# EAGLE design bt-snes-aa-ncp1402-attiny24 (EAGLE 6.1)
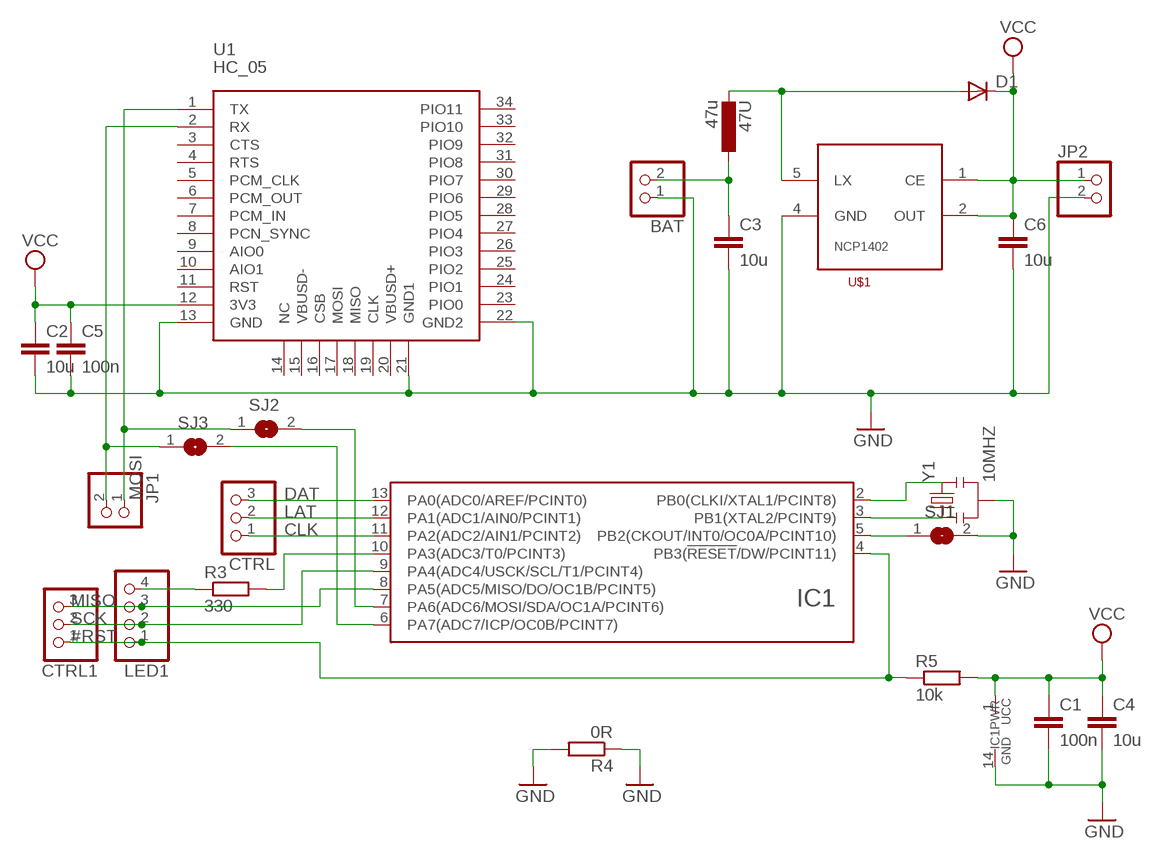
[diagram p0: schematic, sheet 1]

## Parts
47U  47u  L-EUL1210  [C1210]
BAT  PINHD-1X2  [1X02]
C1  100n  C-EUC0805K  [C0805K]
C2  10u  C-EUC0805K  [C0805K]
C3  10u  C-EUC0805K  [C0805K]
C4  10u  C-EUC0805K  [C0805K]
C5  100n  C-EUC0805K  [C0805K]
C6  10u  C-EUC1206  [C1206]
CTRL  PINHD-1X3  [1X03]
CTRL1  PINHD-1X3  [1X03]
D1  DIODE-SOD80C  [SOD80C]
IC1  ATTINY24/44/84-SSU  [SOIC14]
JP1  PINHD-1X2  [1X02]
JP2  PINHD-1X2  [1X02]
LED1  PINHD-1X4  [1X04]
R3  330  R-EU_M0805  [M0805]
R4  0R  R-EU_R1206W  [R1206W]
R5  10k  R-EU_M0805  [M0805]
SJ1  SJ  [SJ]
SJ2  SJ  [SJ]
SJ3  SJ  [SJ]
U1  HC_05  [BLUETOOTH_SMD]
U$1  NCP1402-SOT23-5  [SOT23-5]
Y1  10MHZ  RESONATOR8MHZ  [RESONATOR-SMD]

## Nets
#RST: CTRL1.1 IC1.4(PB3(!RESET!/DW/PCINT11)) LED1.1 R5.1
CLK: CTRL.1 IC1.11(PA2(ADC2/AIN1/PCINT2))
DAT: CTRL.3 IC1.13(PA0(ADC0/AREF/PCINT0))
GND: BAT.1 C1.2 C2.2 C3.2 C4.2 C5.2 C6.2 IC1.14(GND) JP2.2 R4.1 R4.2 SJ1.2 U1.13(GND) U1.21(GND1) U1.22(GND2) U$1.4(GND) Y1.2
LAT: CTRL.2 IC1.12(PA1(ADC1/AIN0/PCINT1))
MISO: CTRL1.3 IC1.8(PA5(ADC5/MISO/DO/OC1B/PCINT5)) LED1.3
MOSI: IC1.7(PA6(ADC6/MOSI/SDA/OC1A/PCINT6)) SJ2.2
N$1: IC1.3(PB1(XTAL2/PCINT9)) Y1.1
N$2: IC1.2(PB0(CLKI/XTAL1/PCINT8)) Y1.3
N$3: JP1.1 SJ2.1 U1.1(TX)
N$5: JP1.2 SJ3.1 U1.2(RX)
N$11: IC1.6(PA7(ADC7/ICP/OC0B/PCINT7)) SJ3.2
N$12: IC1.5(PB2(CKOUT/INT0/OC0A/PCINT10)) SJ1.1
N$13: 47U.1 BAT.2 C3.1
N$14: 47U.2 D1.A U$1.5(LX)
N$15: LED1.4 R3.1
N$20: IC1.10(PA3(ADC3/T0/PCINT3)) R3.2
SCK: CTRL1.2 IC1.9(PA4(ADC4/USCK/SCL/T1/PCINT4)) LED1.2
VCC: C1.1 C2.1 C4.1 C5.1 C6.1 D1.C IC1.1(UCC) JP2.1 R5.2 U1.12(3V3) U$1.1(CE) U$1.2(OUT)
Unconnected: U1.3(CTS) U1.4(RTS) U1.5(PCM_CLK) U1.6(PCM_OUT) U1.7(PCM_IN) U1.8(PCN_SYNC) U1.9(AIO0) U1.10(AIO1) U1.11(RST) U1.14(NC) U1.15(VBUSD-) U1.16(CSB) U1.17(MOSI) U1.18(MISO) U1.19(CLK) U1.20(VBUSD+) U1.23(PIO0) U1.24(PIO1) U1.25(PIO2) U1.26(PIO3) U1.27(PIO4) U1.28(PIO5) U1.29(PIO6) U1.30(PIO7) U1.31(PIO8) U1.32(PIO9) U1.33(PIO10) U1.34(PIO11)

## Library data of the parts
47U = _MY_OWN_LIB:L-EU: INDUCTOR, European symbol
BAT JP1 JP2 = pinhead:PINHD-1X2: PIN HEADER
C1-C6 = rcl:C-EU: CAPACITOR, European symbol
CTRL CTRL1 = pinhead:PINHD-1X3: PIN HEADER
D1 = diode:DIODE-: DIODE
IC1 = atmel_tiny24-44-84tiny48-88mega48-88-168-328:ATTINY24/44/84
LED1 = pinhead:PINHD-1X4: PIN HEADER
R3-R5 = rcl:R-EU_: RESISTOR, European symbol
SJ1-SJ3 = jumper:SJ: SMD solder JUMPER
U1 = SerialPortBluetooth:HC_05
U$1 = _MY_OWN_LIB:NCP1402
Y1 = SparkFun-FreqCtrl:RESONATOR: Resonator Small SMD resonator. Used, eg, on the Arduino Pro/ Pro Mini boards. 8MHz- XTAL-08895 16MHz- XTAL-08900; PROD_ID: XTAL-08895; VALUE: 8MHZ

## Board
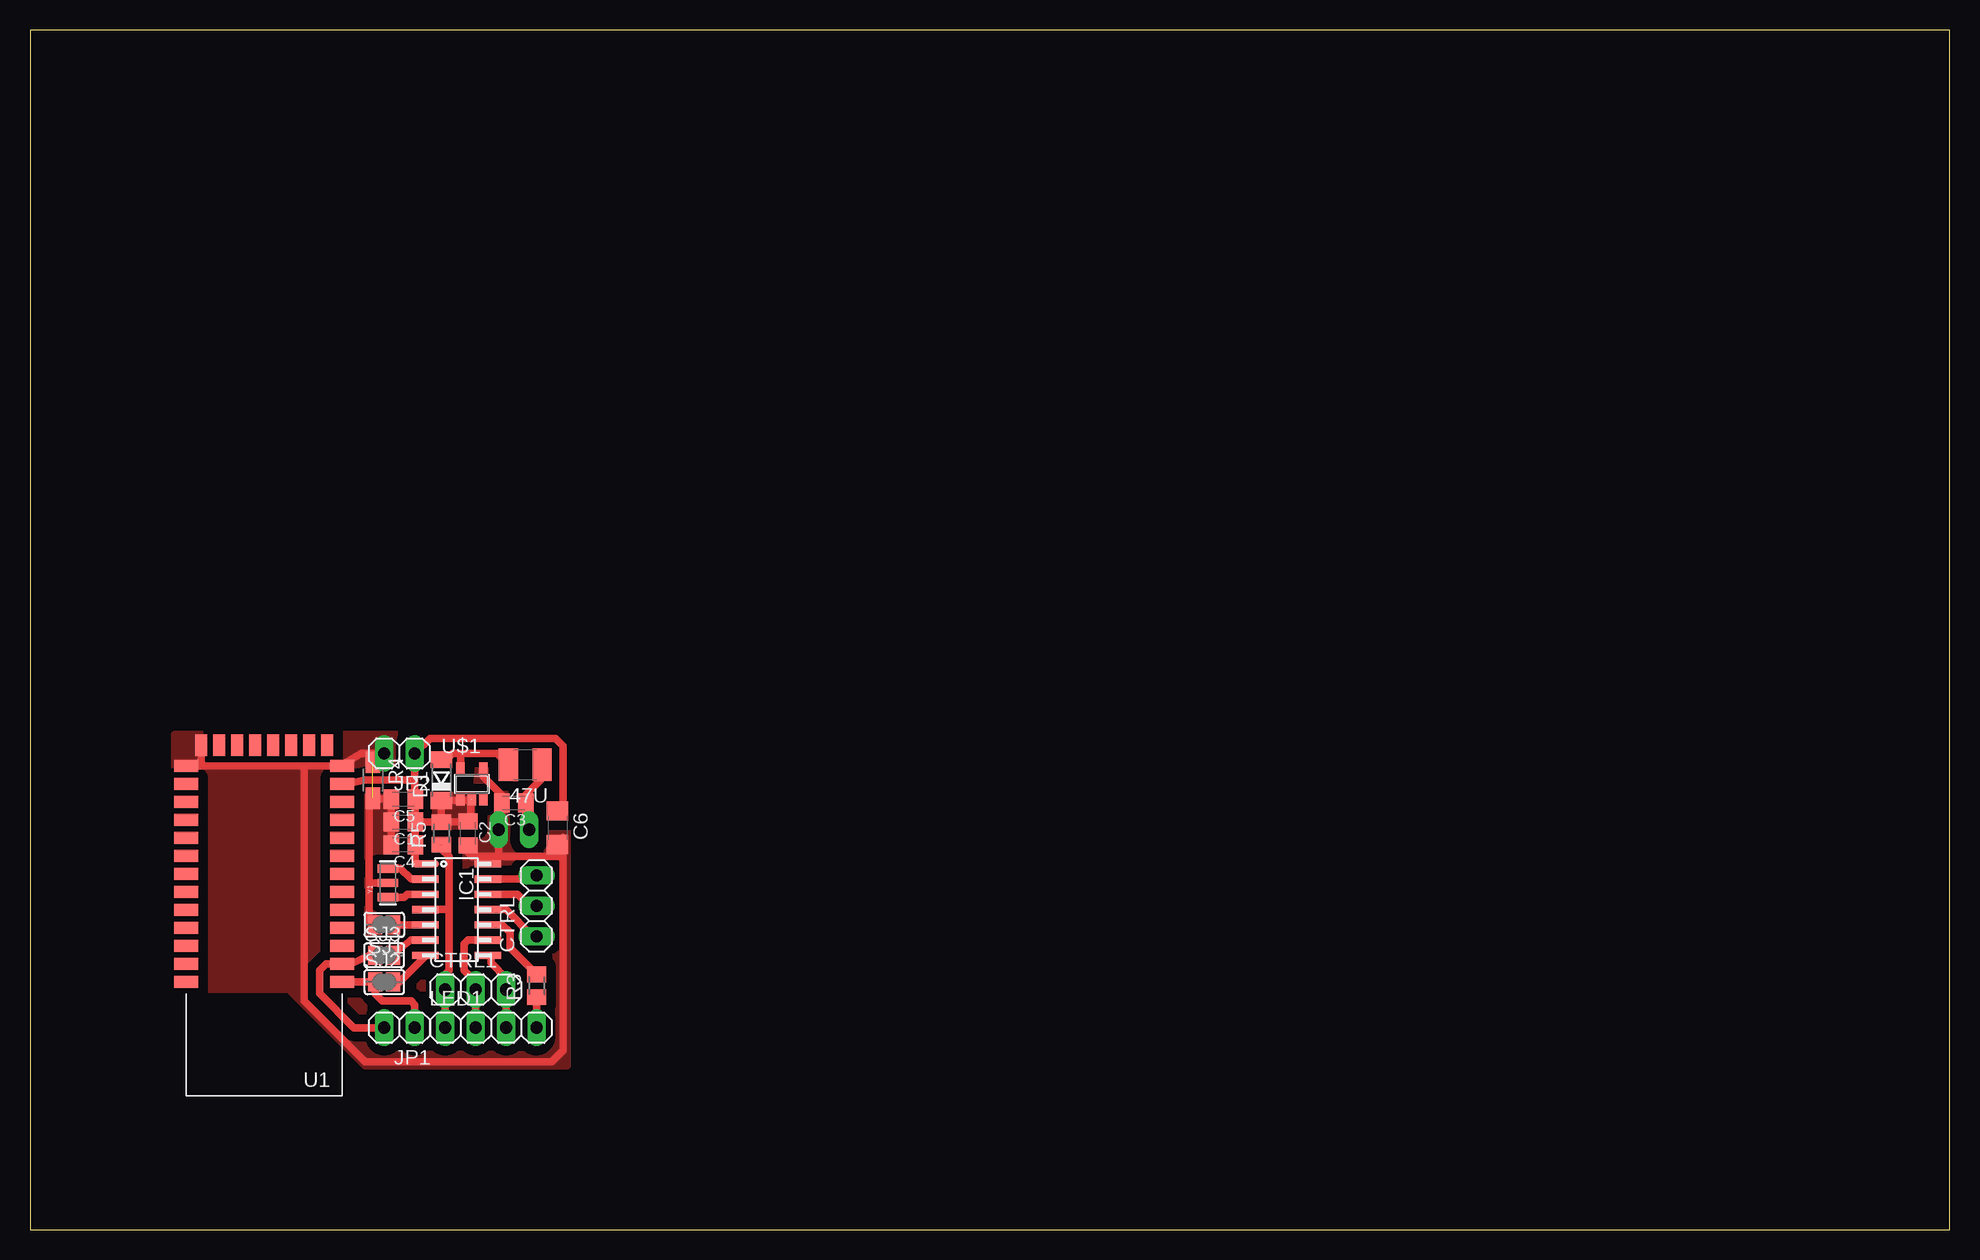
[diagram p1: board, top side]
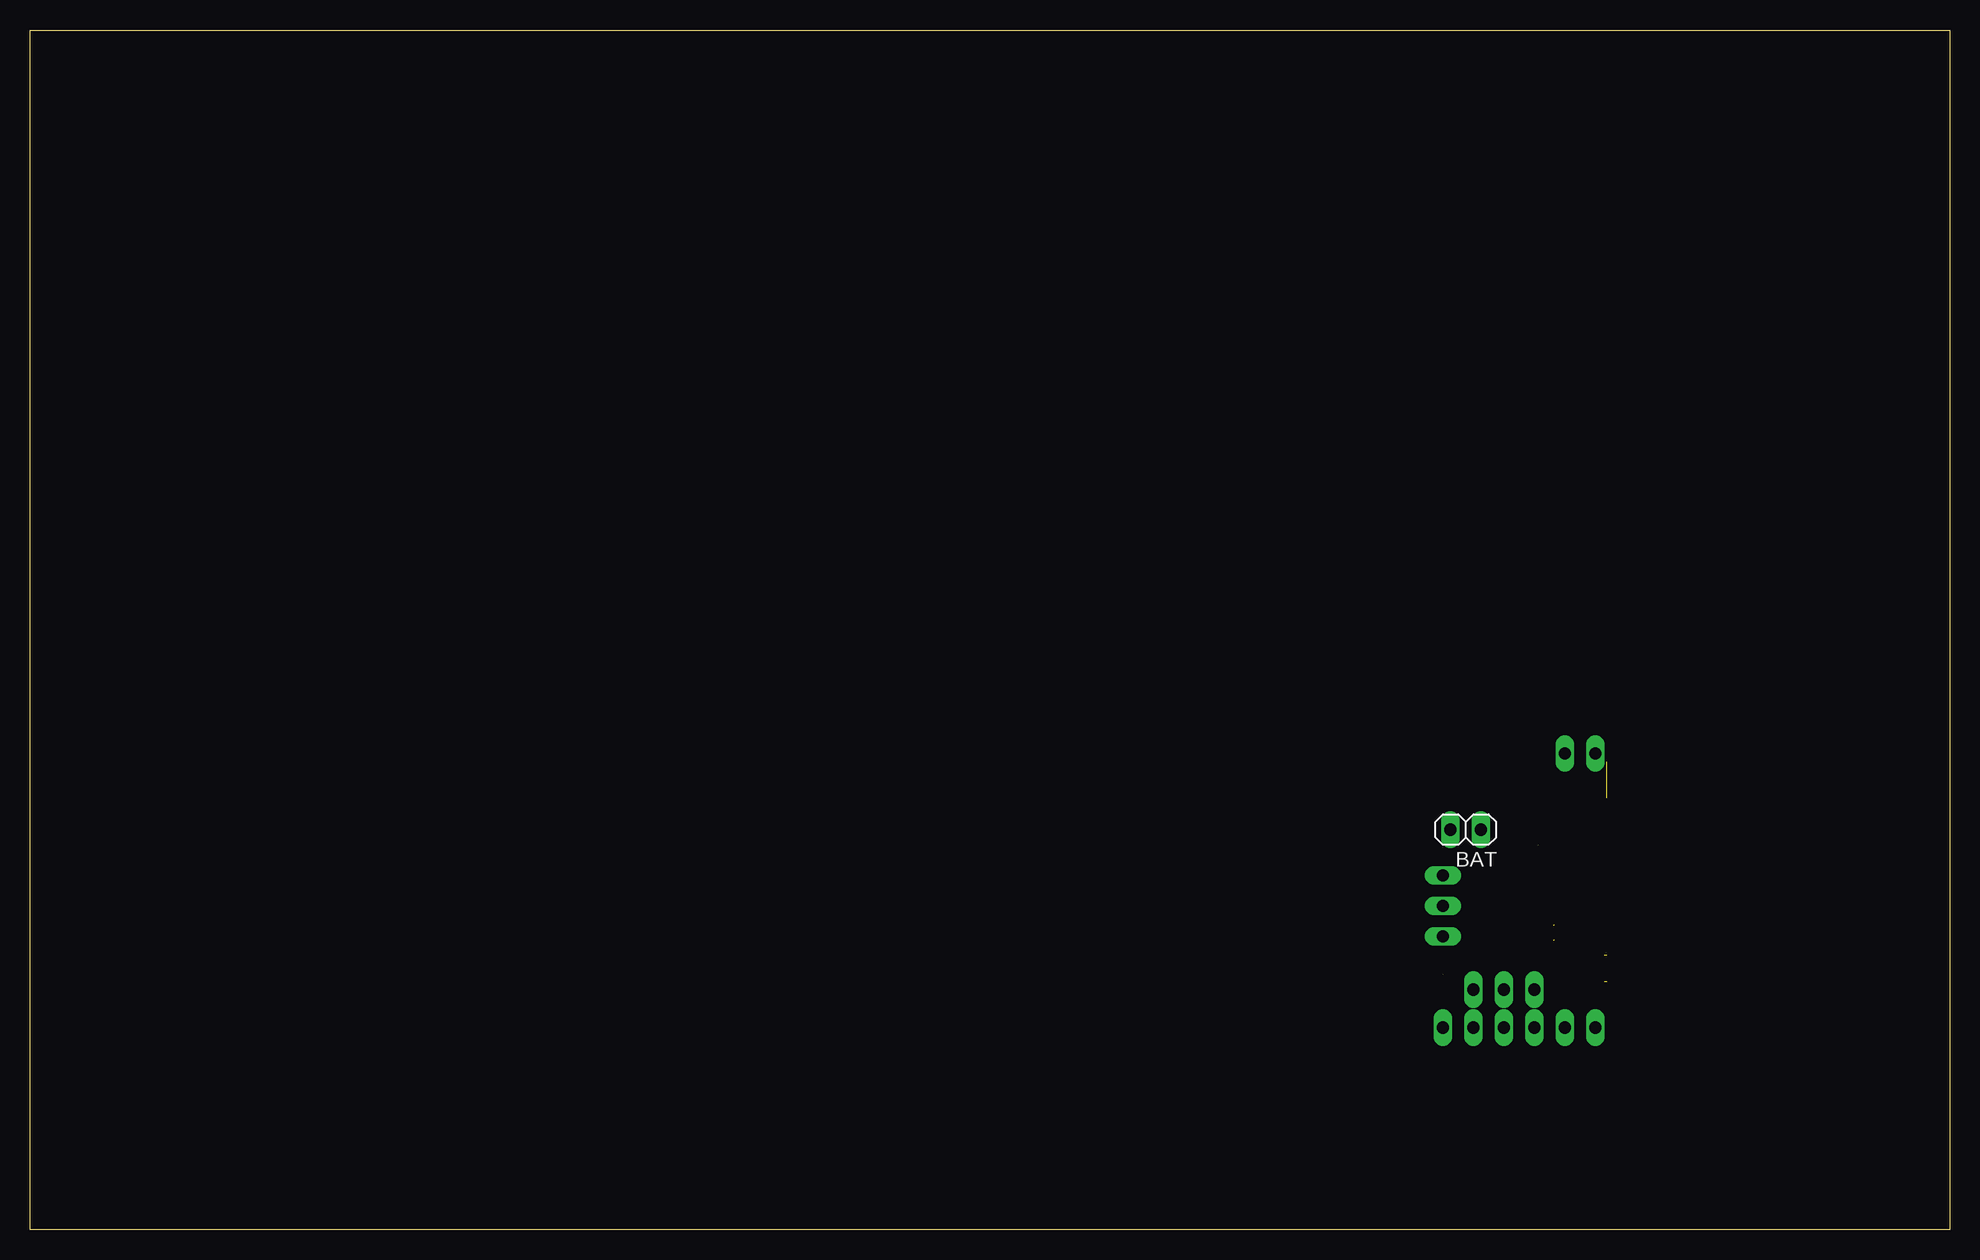
[diagram p2: board, bottom side, seen from below]

Size 160 x 100 mm. Coordinates in mm from the lower left corner, seen from the top.
Outline: 0,0 160,0 160,100 0,100 0,0
Copper layers (1*16): Top 0.035mm / dielectric 1.5mm / Bottom 0.035mm
Design rules: minimum track width 10mil, minimum drill 24mil, track to track 8mil, track to pad 8mil, pad to pad 8mil, via to via 8mil, smd to smd 8mil, copper to edge 40mil, drill to drill 8mil, minimum pad ring 10mil, minimum via ring 8mil, stop-mask expansion 4mil, vias tented up to drill 0mil, thermal gap 10mil

### Footprints (pad centres in the part's own frame; a part is rotated, then mirrored left to right if it is on the bottom)
C1210 = smd 1.6 x 2.7: 1 -1.4,0; 2 1.4,0
1X02 = drill 1.016 long: 1 -1.27,0; 2 1.27,0
C0805K = smd 1.3 x 1.6: 1 -1,0; 2 1,0
C1206 = smd 1.6 x 1.8: 1 -1.4,0; 2 1.4,0
1X03 = drill 1.016 long: 1 -2.54,0; 2 0,0; 3 2.54,0
SOD80C = smd 1.4 x 1.8: A 1.7,0; C -1.7,0
SOIC14 = smd 0.61 x 2.21: 1 -3.81,-2.603; 2 -2.54,-2.603; 3 -1.27,-2.603; 4 0,-2.603; 5 1.27,-2.603; 6 2.54,-2.603; 7 3.81,-2.603; 8 3.81,2.603; 9 2.54,2.603; 10 1.27,2.603; 11 0,2.603; 12 -1.27,2.603; 13 -2.54,2.603; 14 -3.81,2.603
1X04 = drill 1.016 long: 1 -3.81,0; 2 -1.27,0; 3 1.27,0; 4 3.81,0
M0805 = smd 1.3 x 1.6: 1 -0.95,0; 2 0.95,0
R1206W = smd 1.8 x 1.2: 1 -1.499,0; 2 1.499,0
SJ = smd 1.168 x 1.6: 1 -0.762,0; 2 0.762,0
BLUETOOTH_SMD = smd 2 x 1: 1 0,0; 2 0,-1.5; 3 0,-3; 4 0,-4.5; 5 0,-6; 6 0,-7.5; 7 0,-9; 8 0,-10.5; 9 0,-12; 10 0,-13.5; 11 0,-15; 12 0,-16.5; 13 0,-18; 22 13,-18; 23 13,-16.5; 24 13,-15; 25 13,-13.5; 26 13,-12; 27 13,-10.5; 28 13,-9; 29 13,-7.5; 30 13,-6; 31 13,-4.5; 32 13,-3; 33 13,-1.5; 34 13,0 | smd 1 x 1.8: 14 1.25,-19.75; 15 2.75,-19.75; 16 4.25,-19.75; 17 5.75,-19.75; 18 7.25,-19.75; 19 8.75,-19.75; 20 10.25,-19.75; 21 11.75,-19.75
SOT23-5 = smd 0.69 x 0.99: 1 -0.95,-1.29; 2 0,-1.29; 3 0.95,-1.29; 4 0.95,1.3; 5 -0.95,1.3
RESONATOR-SMD = smd 0.7 x 1.7: 1 -1.2,0; 2 0,0; 3 1.2,0

### Placement (x,y rotation side)
47U  41.27,38.73 180 top
BAT  40.32,33.34 180 bottom
C1  31.11,33.97 180 top
C2  36.51,33.02 270 top
C3  40.32,35.56 180 top
C4  31.11,32.07 180 top
C5  31.11,35.88 180 top
C6  43.97,33.5 270 top
CTRL  42.23,26.99 90 top
CTRL1  37.15,20 0 top
D1  34.29,37.47 90 top
IC1  35.56,26.67 270 top
JP1  30.8,16.83 180 top
JP2  30.8,39.69 180 top
LED1  38.42,16.83 0 top
R3  42.23,20.32 90 top
R4  28.57,37.47 270 top
R5  34.29,33.02 90 top
SJ1  29.53,25.4 180 top
SJ2  29.53,20.64 0 top
SJ3  29.53,22.86 0 top
U1  26.04,20.64 180 top
U$1  36.83,37.15 0 top
Y1  29.84,28.89 90 top

### Tracks (layer width: path | path; a pad name or v marks a point on that pad's centre or on a via)
#RST  (1 unrouted)
  Top 0.61: IC1.4 34.92,26.67 | 34.92,26.67 34.92,31.11 34.29,31.75 R5.1 | 34.92,26.67 34.92,21.59 34.61,21.27 CTRL1.1 LED1.1
CLK
  Top 0.61: IC1.11 39.69,26.67 41.91,24.45 CTRL.1
DAT
  Top 0.61: IC1.13 41.91,29.21 CTRL.3
GND  (1 unrouted)
  Top 0.61: 38.42,30.48 IC1.14 38.73,31.05 38.73,31.11 | 44.45,31.11 44.45,14.92 43.5,13.97 27.94,13.97 22.86,19.05 22.86,38.64 | 38.73,31.11 39.05,31.11 | 39.05,31.11 44.45,31.11 | 38.73,31.11 36.83,31.11 36.51,31.43 36.51,32.07 | Y1.2 28.26,28.89 | C4.2 C1.2 30.11,35.83 30.16,35.88 | 14.29,38.64 U1.21 | U1.22 14.29,38.64 | 14.29,38.64 22.86,38.64 | 22.86,38.64 U1.13 25.5,38.73 26.04,38.73 27.62,39.69 JP2.2 | 28.26,28.89 28.26,25.72 28.57,25.4 | 28.26,28.89 28.26,35.88 C5.2 | 44.45,31.11 44.45,32.7 44.4,32.66 C6.2 | U$1.4 37.78,37.78 39.37,36.2 39.37,35.61 C3.2 39.32,33.61 BAT.1 39.05,31.11
  pour Top (isolate 0.813, no thermals): 12.06,41.27 44.77,41.27 44.77,13.65 27.94,13.65 22.23,19.37 21.91,19.68 21.59,20 12.06,20
LAT
  Top 0.61: IC1.12 40.64,27.94 41.59,26.99 CTRL.2
MISO
  Top 0.61: IC1.8 38.42,22.86 38.42,22.23 39.69,20.95 CTRL1.3 LED1.3
MOSI
  Top 0.61: IC1.7 33.02,22.86 30.8,20.64 SJ2.2
N$1
  Top 0.61: Y1.1 31.18,27.69 31.43,27.94 IC1.3
N$2
  Top 0.61: Y1.3 30.87,30.09 31.75,29.21 IC1.2
N$3  (1 unrouted)
  Top 0.61: JP1.1 32.07,18.73 31.75,19.05 29.37,19.05 28.77,19.65 28.77,20.19 28.57,20.64 U1.1
N$5  (1 unrouted)
  Top 0.61: 28.57,22.86 28.26,22.86 26.76,22.14 U1.2 24.68,22.14 24.13,21.59 24.13,19.68 26.99,16.83 JP1.2
N$11  (1 unrouted)
  Top 0.61: SJ3.2 30.16,22.86 31.75,24.13 33.02,24.13
N$12  (1 unrouted)
  Top 0.61: SJ1.1 33.02,25.4
N$13
  Top 0.61: BAT.2 41.32,33.61 C3.1 41.32,36.24 42.55,37.47 42.55,38.6 47U.1
N$14
  Top 0.61: D1.A 34.72,39.16 35.24,39.69 35.88,39.69 | 35.88,39.69 38.92,39.69 47U.2 | U$1.5 35.88,39.69
N$15
  Top 0.61: R3.1 LED1.4
N$20  (1 unrouted)
  Top 0.61: IC1.10 39.37,25.4 40.01,24.77 40.01,23.5 R3.2 42.23,20.95
SCK
  Top 0.61: IC1.9 36.51,24.13 36.2,23.81 36.2,21.59 37.15,20.64 CTRL1.2 LED1.2
VCC
  Top 0.61: IC1.1 32.38,30.48 32.12,30.75 C4.1 C1.1 | C1.1 R5.2 | R5.2 36.46,33.97 | 33.97,34.29 R5.2 | 32.07,37.47 27.94,37.47 26.34,37.14 U1.12 | C1.1 C5.1 32.07,35.92 32.07,37.47 | 32.07,37.47 JP2.1 33.34,40.96 43.81,40.96 44.45,40.32 44.45,34.61 44.4,34.66 C6.1 | D1.C R5.2 | D1.C 36.74,35.77 | 36.74,35.77 U$1.2 | 36.74,35.77 36.74,34.24 C2.1 | U$1.1 35.79,35.77 D1.C
  pour Top (isolate 0.254, no thermals): 33.66,36.35 33.66,33.5 36.99,33.5 36.99,36.35